# Altium schematic sheet BMU_V50_CellBalancer.SchDoc
size C
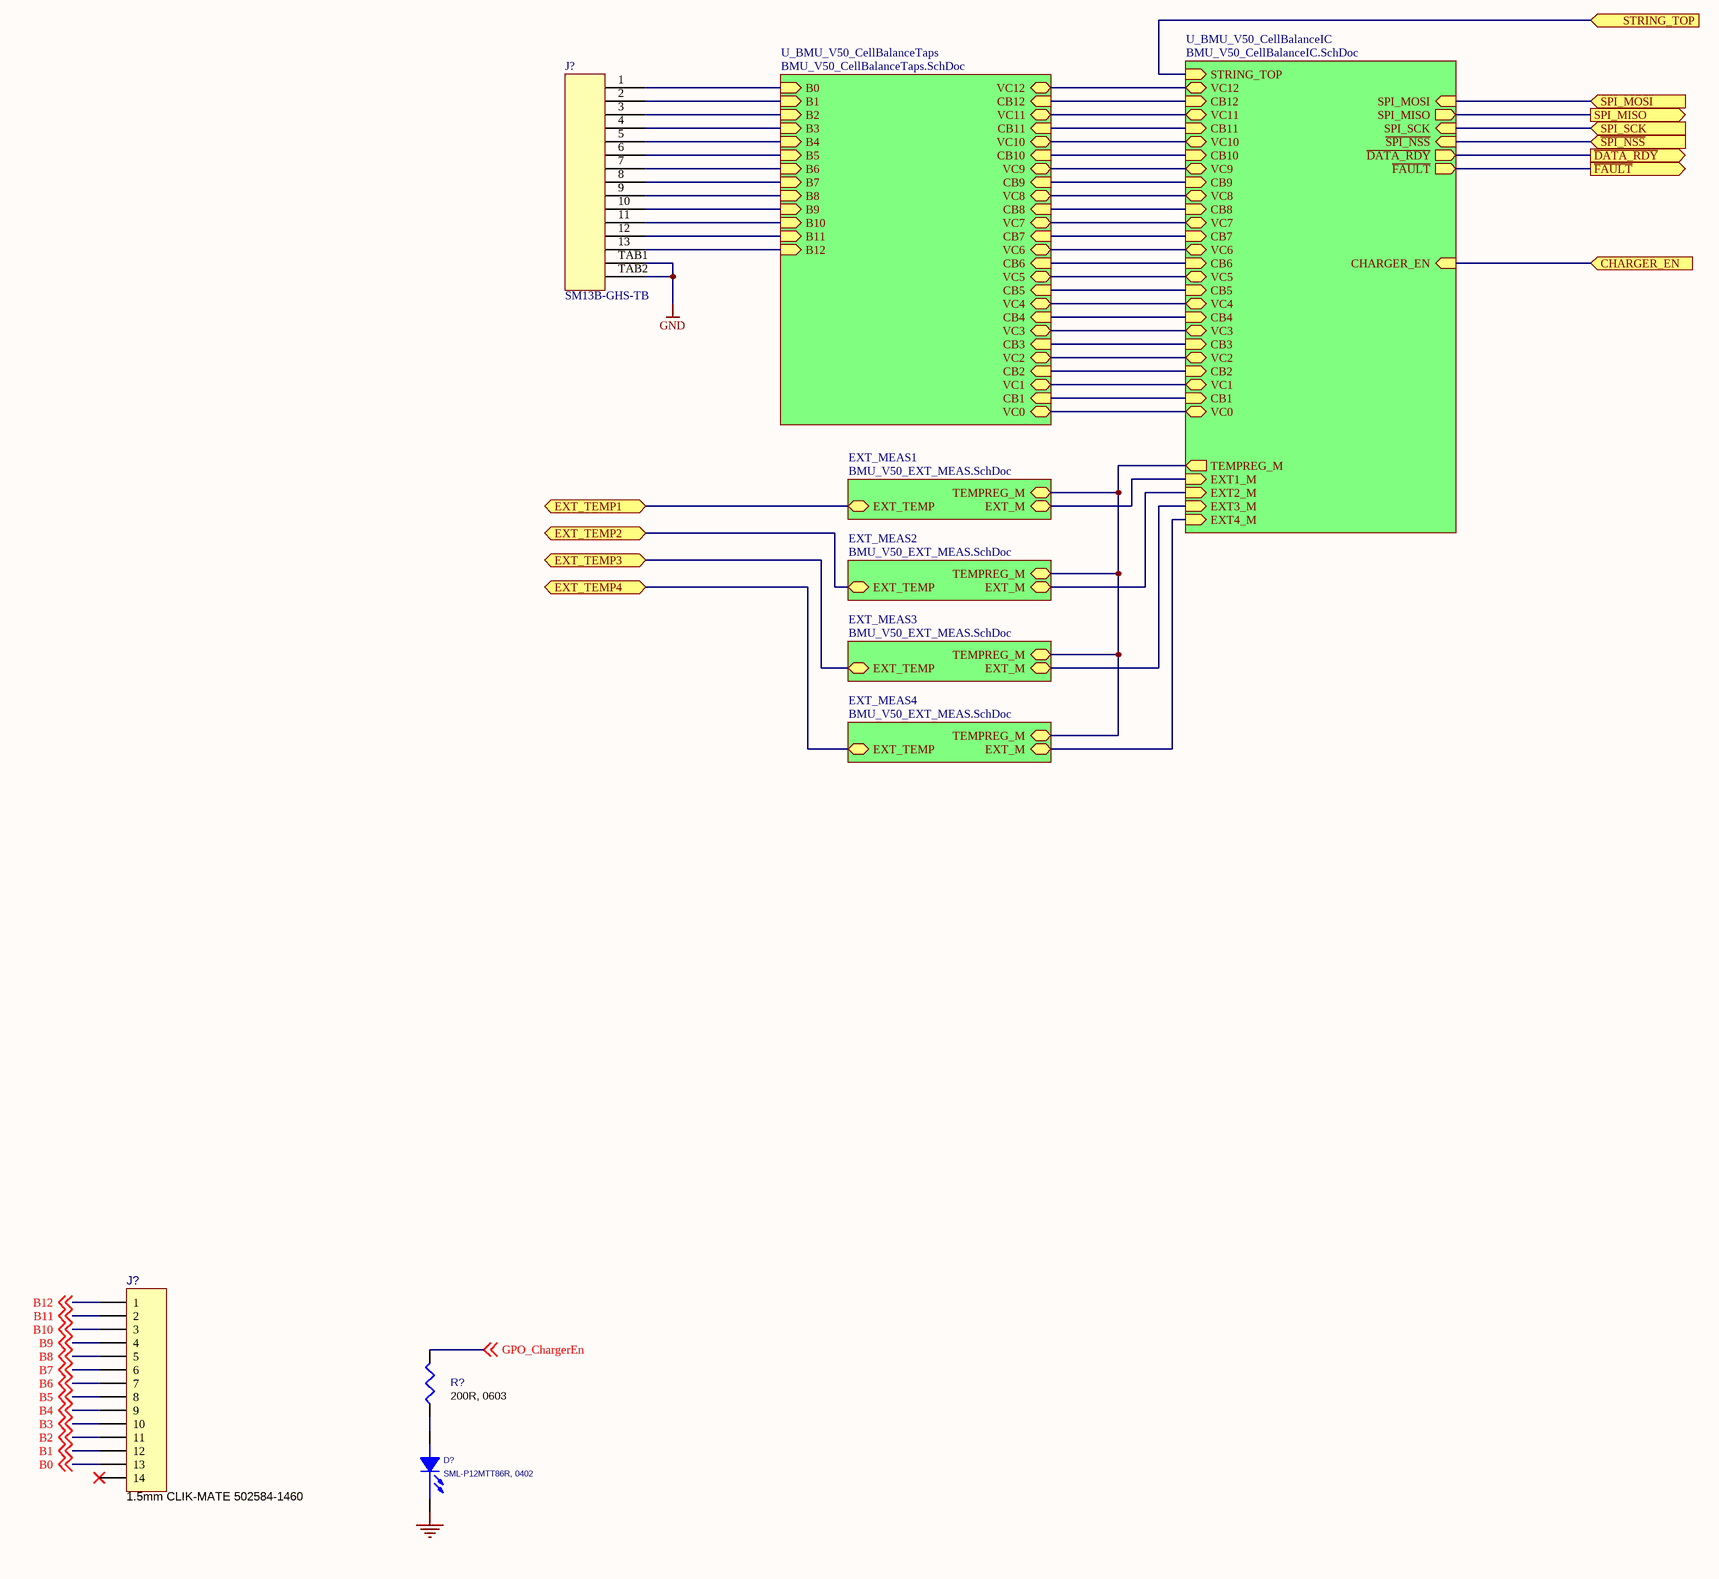
[diagram p0: BMU_V50_CellBalancer.SchDoc]

## Parts
(Parts that share a designator on the sheet are numbered #1, #2 ... from top to bottom, then left to right.)
D?  SML-P12MTT86R, 0402  [D0402]
J?#1  SM13B-GHS-TB  [SM13B-GHS-TB]
J?#2  1.5mm CLIK-MATE 502584-1460  [CONN14_1p5mm_SM]
R?  200R, 0603  [R0603]

## Sub-sheets
EXT_MEAS1 = BMU_V50_EXT_MEAS.SchDoc: EXT_M (bidir), EXT_TEMP (bidir), TEMPREG_M (bidir)
EXT_MEAS2 = BMU_V50_EXT_MEAS.SchDoc: EXT_M (bidir), EXT_TEMP (bidir), TEMPREG_M (bidir)
EXT_MEAS3 = BMU_V50_EXT_MEAS.SchDoc: EXT_M (bidir), EXT_TEMP (bidir), TEMPREG_M (bidir)
EXT_MEAS4 = BMU_V50_EXT_MEAS.SchDoc: EXT_M (bidir), EXT_TEMP (bidir), TEMPREG_M (bidir)
U_BMU_V50_CellBalanceIC = BMU_V50_CellBalanceIC.SchDoc: VC12 (bidir), CB12 (in), CB11 (in), VC11 (bidir), VC10 (bidir), CB10 (in), SPI_SCK (in), ~{FAULT} (out), EXT1_M (in), EXT3_M (in), EXT2_M (in), SPI_MOSI (in), ~{SPI_NSS} (in), CHARGER_EN (in), STRING_TOP (in), EXT4_M (in), ~{DATA_RDY} (out), SPI_MISO (out), VC9 (bidir), CB9 (in), VC8 (bidir), CB8 (in), VC7 (bidir), CB7 (in), VC6 (bidir), CB6 (in), VC5 (bidir), CB5 (in), VC4 (bidir), CB4 (in), VC3 (bidir), CB3 (in), VC2 (bidir), CB2 (in), VC1 (bidir), CB1 (in), VC0 (bidir), TEMPREG_M (out)
U_BMU_V50_CellBalanceTaps = BMU_V50_CellBalanceTaps.SchDoc: B11 (in), CB4 (in), B9 (in), VC6 (bidir), B2 (in), CB10 (in), B10 (in), CB5 (in), B12 (in), CB7 (in), B5 (in), B8 (in), VC5 (bidir), CB12 (in), VC0 (bidir), VC12 (bidir), VC8 (bidir), CB8 (in), VC2 (bidir), B0 (in), CB11 (in), B7 (in), VC7 (bidir), VC11 (bidir), B4 (in), B6 (in), VC9 (bidir), B1 (in), B3 (in), CB6 (in), VC1 (bidir), CB3 (in), CB9 (in), CB2 (in), VC10 (bidir), VC3 (bidir), CB1 (in), VC4 (bidir)

## Ports
CHARGER_EN (in), EXT_TEMP1 (bidir), EXT_TEMP2 (bidir), EXT_TEMP3 (bidir), EXT_TEMP4 (bidir), SPI_MISO (out), SPI_MOSI (in), SPI_SCK (in), STRING_TOP (in), ~{DATA_RDY} (out), ~{FAULT} (out), ~{SPI_NSS} (in)

## Nets
GND: D?.C(CATHODE) J?#1.TAB1 J?#1.TAB2
B0: J?#2.13 ; off-sheet B0
B1: J?#2.12 ; off-sheet B1
B2: J?#2.11 ; off-sheet B2
B3: J?#2.10 ; off-sheet B3
B4: J?#2.9 ; off-sheet B4
B5: J?#2.8 ; off-sheet B5
B6: J?#2.7 ; off-sheet B6
B7: J?#2.6 ; off-sheet B7
B8: J?#2.5 ; off-sheet B8
B9: J?#2.4 ; off-sheet B9
B10: J?#2.3 ; off-sheet B10
B11: J?#2.2 ; off-sheet B11
B12: J?#2.1 ; off-sheet B12
CHARGER_EN: port CHARGER_EN, sheet U_BMU_V50_CellBalanceIC/CHARGER_EN
~{DATA_RDY}: port ~{DATA_RDY}, sheet U_BMU_V50_CellBalanceIC/~{DATA_RDY}
EXT_TEMP1: port EXT_TEMP1, sheet EXT_MEAS1/EXT_TEMP
EXT_TEMP2: port EXT_TEMP2, sheet EXT_MEAS2/EXT_TEMP
EXT_TEMP3: port EXT_TEMP3, sheet EXT_MEAS3/EXT_TEMP
EXT_TEMP4: port EXT_TEMP4, sheet EXT_MEAS4/EXT_TEMP
~{FAULT}: port ~{FAULT}, sheet U_BMU_V50_CellBalanceIC/~{FAULT}
GPO_ChargerEn: R?.2 ; off-sheet GPO_ChargerEn
~{SPI_NSS}: port ~{SPI_NSS}, sheet U_BMU_V50_CellBalanceIC/~{SPI_NSS}
SPI_MISO: port SPI_MISO, sheet U_BMU_V50_CellBalanceIC/SPI_MISO
SPI_MOSI: port SPI_MOSI, sheet U_BMU_V50_CellBalanceIC/SPI_MOSI
SPI_SCK: port SPI_SCK, sheet U_BMU_V50_CellBalanceIC/SPI_SCK
STRING_TOP: port STRING_TOP, sheet U_BMU_V50_CellBalanceIC/STRING_TOP
NetD?_A: D?.A(ANODE) R?.1
NetJ?#1_1: J?#1.1 ; sheet U_BMU_V50_CellBalanceTaps/B0
NetJ?#1_2: J?#1.2 ; sheet U_BMU_V50_CellBalanceTaps/B1
NetJ?#1_3: J?#1.3 ; sheet U_BMU_V50_CellBalanceTaps/B2
NetJ?#1_4: J?#1.4 ; sheet U_BMU_V50_CellBalanceTaps/B3
NetJ?#1_5: J?#1.5 ; sheet U_BMU_V50_CellBalanceTaps/B4
NetJ?#1_6: J?#1.6 ; sheet U_BMU_V50_CellBalanceTaps/B5
NetJ?#1_7: J?#1.7 ; sheet U_BMU_V50_CellBalanceTaps/B6
NetJ?#1_8: J?#1.8 ; sheet U_BMU_V50_CellBalanceTaps/B7
NetJ?#1_9: J?#1.9 ; sheet U_BMU_V50_CellBalanceTaps/B8
NetJ?#1_10: J?#1.10 ; sheet U_BMU_V50_CellBalanceTaps/B9
NetJ?#1_11: J?#1.11 ; sheet U_BMU_V50_CellBalanceTaps/B10
NetJ?#1_12: J?#1.12 ; sheet U_BMU_V50_CellBalanceTaps/B11
NetJ?#1_13: J?#1.13 ; sheet U_BMU_V50_CellBalanceTaps/B12
(unnamed): sheet U_BMU_V50_CellBalanceTaps/CB4, sheet U_BMU_V50_CellBalanceIC/CB4
(unnamed): sheet U_BMU_V50_CellBalanceTaps/VC6, sheet U_BMU_V50_CellBalanceIC/VC6
(unnamed): sheet U_BMU_V50_CellBalanceTaps/CB10, sheet U_BMU_V50_CellBalanceIC/CB10
(unnamed): sheet U_BMU_V50_CellBalanceTaps/CB5, sheet U_BMU_V50_CellBalanceIC/CB5
(unnamed): sheet U_BMU_V50_CellBalanceTaps/CB7, sheet U_BMU_V50_CellBalanceIC/CB7
(unnamed): sheet U_BMU_V50_CellBalanceTaps/VC5, sheet U_BMU_V50_CellBalanceIC/VC5
(unnamed): sheet U_BMU_V50_CellBalanceTaps/CB12, sheet U_BMU_V50_CellBalanceIC/CB12
(unnamed): sheet U_BMU_V50_CellBalanceTaps/VC0, sheet U_BMU_V50_CellBalanceIC/VC0
(unnamed): sheet U_BMU_V50_CellBalanceTaps/VC12, sheet U_BMU_V50_CellBalanceIC/VC12
(unnamed): sheet U_BMU_V50_CellBalanceTaps/VC8, sheet U_BMU_V50_CellBalanceIC/VC8
(unnamed): sheet U_BMU_V50_CellBalanceTaps/CB8, sheet U_BMU_V50_CellBalanceIC/CB8
(unnamed): sheet U_BMU_V50_CellBalanceTaps/VC2, sheet U_BMU_V50_CellBalanceIC/VC2
(unnamed): sheet U_BMU_V50_CellBalanceTaps/CB11, sheet U_BMU_V50_CellBalanceIC/CB11
(unnamed): sheet U_BMU_V50_CellBalanceTaps/VC7, sheet U_BMU_V50_CellBalanceIC/VC7
(unnamed): sheet U_BMU_V50_CellBalanceTaps/VC11, sheet U_BMU_V50_CellBalanceIC/VC11
(unnamed): sheet U_BMU_V50_CellBalanceTaps/VC9, sheet U_BMU_V50_CellBalanceIC/VC9
(unnamed): sheet U_BMU_V50_CellBalanceTaps/CB6, sheet U_BMU_V50_CellBalanceIC/CB6
(unnamed): sheet U_BMU_V50_CellBalanceTaps/VC1, sheet U_BMU_V50_CellBalanceIC/VC1
(unnamed): sheet U_BMU_V50_CellBalanceTaps/CB3, sheet U_BMU_V50_CellBalanceIC/CB3
(unnamed): sheet U_BMU_V50_CellBalanceTaps/CB9, sheet U_BMU_V50_CellBalanceIC/CB9
(unnamed): sheet U_BMU_V50_CellBalanceTaps/CB2, sheet U_BMU_V50_CellBalanceIC/CB2
(unnamed): sheet U_BMU_V50_CellBalanceTaps/VC10, sheet U_BMU_V50_CellBalanceIC/VC10
(unnamed): sheet U_BMU_V50_CellBalanceTaps/VC3, sheet U_BMU_V50_CellBalanceIC/VC3
(unnamed): sheet U_BMU_V50_CellBalanceTaps/CB1, sheet U_BMU_V50_CellBalanceIC/CB1
(unnamed): sheet U_BMU_V50_CellBalanceTaps/VC4, sheet U_BMU_V50_CellBalanceIC/VC4
(unnamed): sheet U_BMU_V50_CellBalanceIC/EXT1_M, sheet EXT_MEAS1/EXT_M
(unnamed): sheet U_BMU_V50_CellBalanceIC/EXT3_M, sheet EXT_MEAS3/EXT_M
(unnamed): sheet U_BMU_V50_CellBalanceIC/EXT2_M, sheet EXT_MEAS2/EXT_M
(unnamed): sheet U_BMU_V50_CellBalanceIC/EXT4_M, sheet EXT_MEAS4/EXT_M
(unnamed): sheet U_BMU_V50_CellBalanceIC/TEMPREG_M, sheet EXT_MEAS1/TEMPREG_M, sheet EXT_MEAS2/TEMPREG_M, sheet EXT_MEAS3/TEMPREG_M, sheet EXT_MEAS4/TEMPREG_M

Not connected (* = marked no-connect by the designer): J?#2 14*

## Notes on the sheet
- Title
- MATTERNET
- PROPRIETRY & CONFIDENTIAL
  THE INFORMATION CONTAINS IN THIS DRAWING
  IS THE SOLE PROPERTY OF  MATTERNET Inc.
  ANY REPRODUCTION IN PART OR AS WHOLE
  WITHOUT A WRITTEN PERMISSION OF
  MATTERNET Inc. IS PROHIBITED
- Size:
- Date:
- File:
- C
- Number:
- Time:
- Revision:
- Sheet
- of
- 161 E. Evelyn Ave.
- Mountain View,
- CA 94041 USA

## Library data of the parts
D? = LED-GENERIC: custinv: Ansync; custprt: 100-0500-000159; Option: AB
J?#1 = SM13B-GHS-TB: CONN HEADER GH SIDE 13POS 1.25MM; System: Connector; Supplier 1: Digi-Key; Supplier Part Number 1: 455-1575-1-ND
J?#2 = Header 14: CONN RCPT 14POS 0.059 TIN SMD; Manufacturer: Molex; Current Rating: 2A; Voltage Rating: 100V; Number of Positions: 14; Connector Type: Forked,Receptacle; Gender: Female; Glow Wire Compliant: Non-compliant; ComponentLink1URL: http://www.mouser.com/ds/2/276/5025841460_PCB_RECEPTACLES-179505.pdf; ComponentLink1Description: http://www.mouser.com/ds/2/276/5025841460_PCB_RECEPTACLES-179505.pdf; ComponentLink2URL: http://www.molex.com/pdm_docs/sd/5025841460_sd.pdf; ComponentLink2Description: http://www.molex.com/pdm_docs/sd/5025841460_sd.pdf; ComponentLink3URL: http://www.molex.com/webdocs/datasheets/pdf/en-us/5025841460_PCB_RECEPTACLES.pdf; ComponentLink3Description: http://www.molex.com/webdocs/datasheets/pdf/en-us/5025841460_PCB_RECEPTACLES.pdf; Supplier 1: Digikey; Supplier Part Number 1: WM20814CT-ND; Manufacturer Part Number: 502584-1460; Stock 1: 900; Pricing 1: 1=2.58, 10=2.341, 100=2.0064 (USD); Mount: Surface Mount; Color: Beige; Contact Plating: Tin; Contact Gender: Female; Package Quantity: 900; Number of Rows: 1; Packaging: Tape and Reel; Fastening Type: Latch; Termination: Solder; Number of Contacts: 14; Orientation: Vertical; Number of Circuits: 14; Pitch: 1.5mm; Radiation Hardening: No; REACH SVHC: No SVHC; Supplier 2: Mouser; Supplier Part Number 2: 538-502584-1460; Stock 2: 5330; Pricing 2: 1=1.96, 10=1.75, 50=1.75, 100=1.52, 1000=1.09, 10000=0.96 (USD); ComponentLink4URL: http://www.mouser.com/ds/2/276/5025841460_PCB_RECEPTACLES-179505.pdf?src-supplier=Mouser; ComponentLink4Description: http://www.mouser.com/ds/2/276/5025841460_PCB_RECEPTACLES-179505.pdf?src-supplier=Mouser; ComponentLink5URL: http://www.molex.com/pdm_docs/sd/5025841460_sd.pdf?src-supplier=Digi-Key; ComponentLink5Description: http://www.molex.com/pdm_docs/sd/5025841460_sd.pdf?src-supplier=Digi-Key; ComponentLink6URL: http://www.molex.com/webdocs/datasheets/pdf/en-us/5025841460_PCB_RECEPTACLES.pdf?src-supplier=Avnet; ComponentLink6Description: http://www.molex.com/webdocs/datasheets/pdf/en-us/5025841460_PCB_RECEPTACLES.pdf?src-supplier=Avnet
R? = R-Generic-0603: RES SMD 200 OHM 1% 1/10W 0603; Manufacturer: Yageo; Manufacturer Part Number: AC0603FR-07200RL; custprt: 100-0110-000074; custinv: Ansync; Option: AB; Max Power Dissipation: 100mW; Temperature Coefficient: 100ppm/°C; Supplier 1: Digi-Key; Supplier Part Number 1: YAG3576CT-ND; Stock 1: 46237; Pricing 1: 1=0.1, 10=0.032, 100=0.0129, 1000=0.00579, 2500=0.00502 (USD); Case/Package: 0603; Case Code (Metric): 1608; Case Code (Imperial): 0603; Min Operating Temperature: -55°C; Max Operating Temperature: 155°C; Packaging: Tape and Reel; Resistance: 200R; Composition: Thick Film; Number of Terminations: 2; Tolerance: 1%; Features: Automotive AEC-Q200,Moisture Resistant; Length: 0.063inch; Height: 0.022inch; Width: 0.031inch